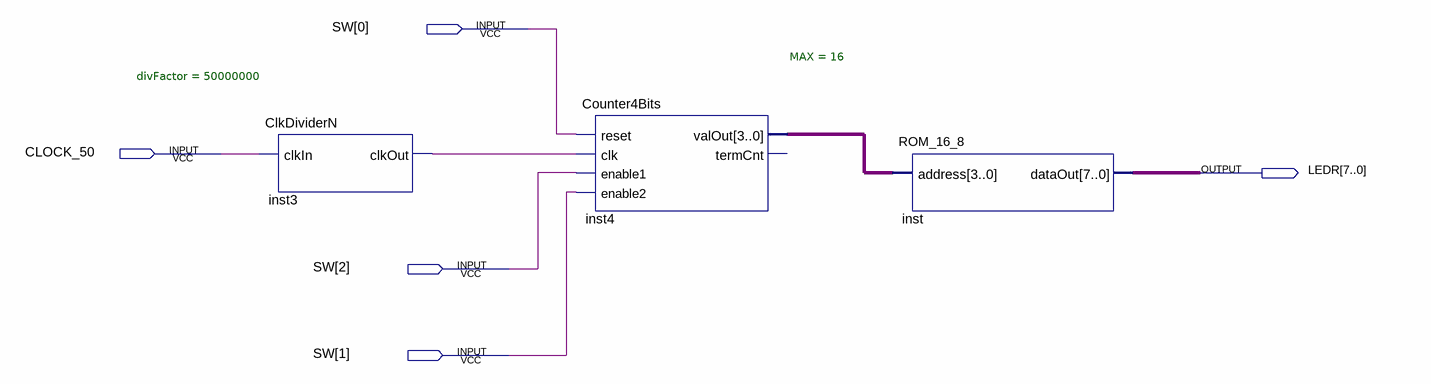
[diagram p0: schematic sheet]
// Quartus schematic ROM_Demo.bdf as structural Verilog: 3 symbols, 5 pins
module ROM_Demo (
  input  [2:0] SW,
  input  CLOCK_50,
  output [7:0] LEDR
);

  wire inst3_clkout;
  wire [3:0] inst4_valout;

  ClkDividerN #(.divFactor(50000000)) inst3 (.clkIn(CLOCK_50), .clkOut(inst3_clkout));
  Counter4Bits #(.MAX(16)) inst4 (
    .reset(SW[0]), .clk(inst3_clkout), .enable1(SW[2]), .enable2(SW[1]), .valOut(inst4_valout));  // open: termCnt
  ROM_16_8 inst (.address(inst4_valout), .dataOut(LEDR));
endmodule
